# EAGLE design BBMiniPCB5x5 (EAGLE 6.6.0)
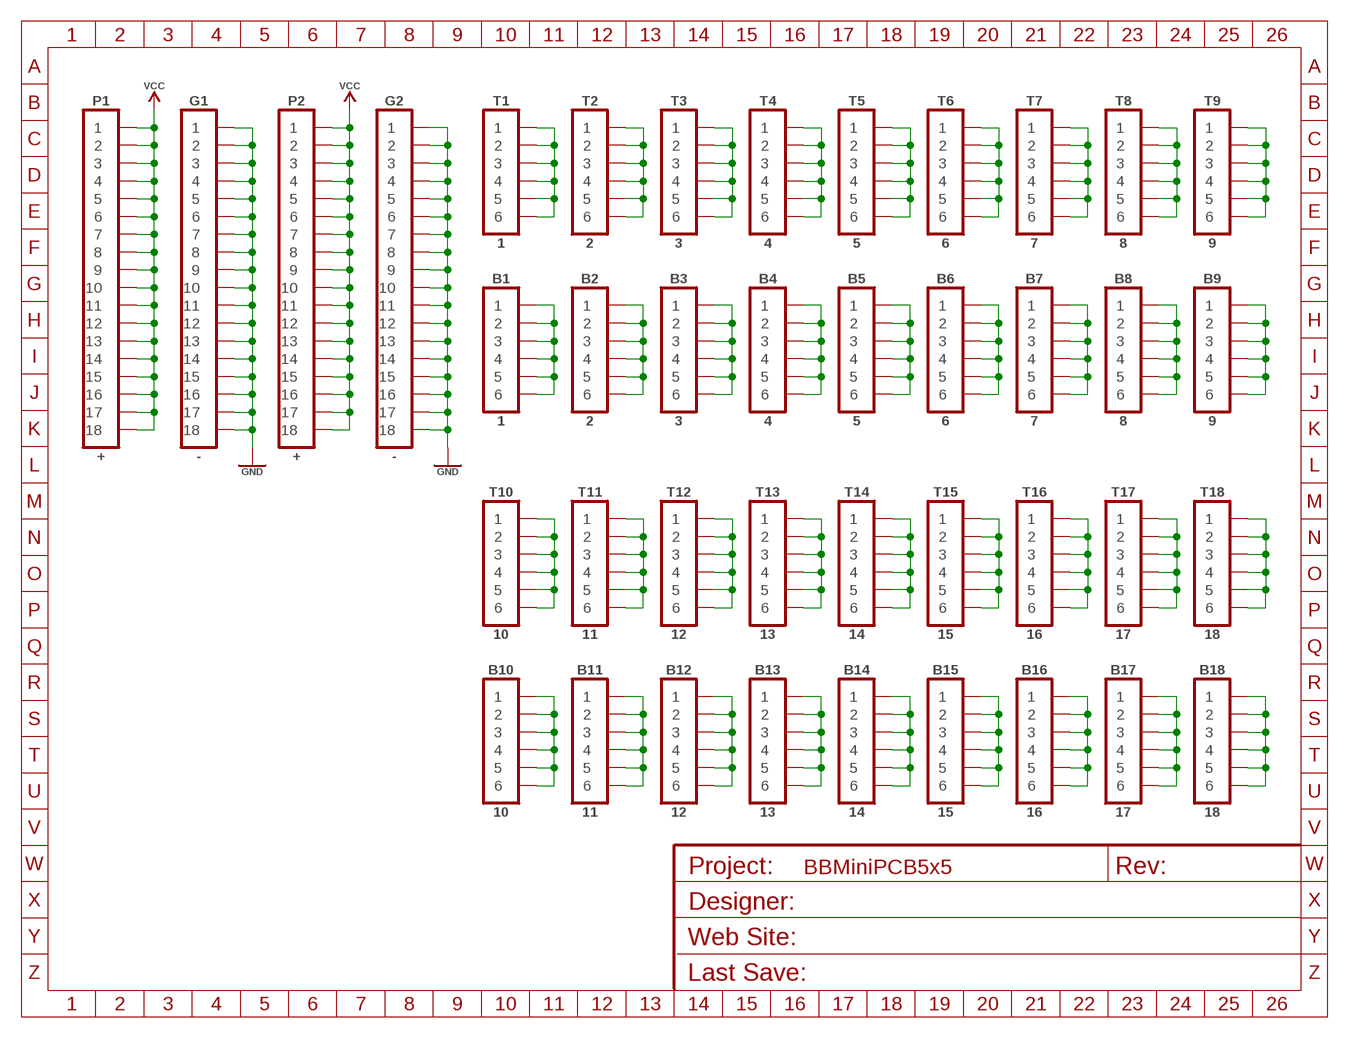
[diagram p0: schematic, sheet 1]
FRAME1 (A5L_FRAME): DESIGNER: Simon/CGTr; REVISION: 1.0; WEBSITE: http://www.commodore.gen.tr

## Parts
B1  1  HDR_1X06_NOSILK  [HDR_1X06_NOSILK]
B2  2  HDR_1X06_NOSILK  [HDR_1X06_NOSILK]
B3  3  HDR_1X06_NOSILK  [HDR_1X06_NOSILK]
B4  4  HDR_1X06_NOSILK  [HDR_1X06_NOSILK]
B5  5  HDR_1X06_NOSILK  [HDR_1X06_NOSILK]
B6  6  HDR_1X06_NOSILK  [HDR_1X06_NOSILK]
B7  7  HDR_1X06_NOSILK  [HDR_1X06_NOSILK]
B8  8  HDR_1X06_NOSILK  [HDR_1X06_NOSILK]
B9  9  HDR_1X06_NOSILK  [HDR_1X06_NOSILK]
B10  10  HDR_1X06_NOSILK  [HDR_1X06_NOSILK]
B11  11  HDR_1X06_NOSILK  [HDR_1X06_NOSILK]
B12  12  HDR_1X06_NOSILK  [HDR_1X06_NOSILK]
B13  13  HDR_1X06_NOSILK  [HDR_1X06_NOSILK]
B14  14  HDR_1X06_NOSILK  [HDR_1X06_NOSILK]
B15  15  HDR_1X06_NOSILK  [HDR_1X06_NOSILK]
B16  16  HDR_1X06_NOSILK  [HDR_1X06_NOSILK]
B17  17  HDR_1X06_NOSILK  [HDR_1X06_NOSILK]
B18  18  HDR_1X06_NOSILK  [HDR_1X06_NOSILK]
G1  -  HDR_1X18_NOSILK  [HDR_1X18_NOSILK]
G2  -  HDR_1X18_NOSILK  [HDR_1X18_NOSILK]
P1  +  HDR_1X18_NOSILK  [HDR_1X18_NOSILK]
P2  +  HDR_1X18_NOSILK  [HDR_1X18_NOSILK]
T1  1  HDR_1X06_NOSILK  [HDR_1X06_NOSILK]
T2  2  HDR_1X06_NOSILK  [HDR_1X06_NOSILK]
T3  3  HDR_1X06_NOSILK  [HDR_1X06_NOSILK]
T4  4  HDR_1X06_NOSILK  [HDR_1X06_NOSILK]
T5  5  HDR_1X06_NOSILK  [HDR_1X06_NOSILK]
T6  6  HDR_1X06_NOSILK  [HDR_1X06_NOSILK]
T7  7  HDR_1X06_NOSILK  [HDR_1X06_NOSILK]
T8  8  HDR_1X06_NOSILK  [HDR_1X06_NOSILK]
T9  9  HDR_1X06_NOSILK  [HDR_1X06_NOSILK]
T10  10  HDR_1X06_NOSILK  [HDR_1X06_NOSILK]
T11  11  HDR_1X06_NOSILK  [HDR_1X06_NOSILK]
T12  12  HDR_1X06_NOSILK  [HDR_1X06_NOSILK]
T13  13  HDR_1X06_NOSILK  [HDR_1X06_NOSILK]
T14  14  HDR_1X06_NOSILK  [HDR_1X06_NOSILK]
T15  15  HDR_1X06_NOSILK  [HDR_1X06_NOSILK]
T16  16  HDR_1X06_NOSILK  [HDR_1X06_NOSILK]
T17  17  HDR_1X06_NOSILK  [HDR_1X06_NOSILK]
T18  18  HDR_1X06_NOSILK  [HDR_1X06_NOSILK]

## Nets
B1: B1.1 B1.2 B1.3 B1.4 B1.5 B1.6
B2: B2.1 B2.2 B2.3 B2.4 B2.5 B2.6
B3: B3.1 B3.2 B3.3 B3.4 B3.5 B3.6
B4: B4.1 B4.2 B4.3 B4.4 B4.5 B4.6
B5: B5.1 B5.2 B5.3 B5.4 B5.5 B5.6
B6: B6.1 B6.2 B6.3 B6.4 B6.5 B6.6
B7: B7.1 B7.2 B7.3 B7.4 B7.5 B7.6
B8: B8.1 B8.2 B8.3 B8.4 B8.5 B8.6
B9: B9.1 B9.2 B9.3 B9.4 B9.5 B9.6
B10: B10.1 B10.2 B10.3 B10.4 B10.5 B10.6
B11: B11.1 B11.2 B11.3 B11.4 B11.5 B11.6
B12: B12.1 B12.2 B12.3 B12.4 B12.5 B12.6
B13: B13.1 B13.2 B13.3 B13.4 B13.5 B13.6
B14: B14.1 B14.2 B14.3 B14.4 B14.5 B14.6
B15: B15.1 B15.2 B15.3 B15.4 B15.5 B15.6
B16: B16.1 B16.2 B16.3 B16.4 B16.5 B16.6
B17: B17.1 B17.2 B17.3 B17.4 B17.5 B17.6
B18: B18.1 B18.2 B18.3 B18.4 B18.5 B18.6
GND: G1.1 G1.2 G1.3 G1.4 G1.5 G1.6 G1.7 G1.8 G1.9 G1.10 G1.11 G1.12 G1.13 G1.14 G1.15 G1.16 G1.17 G1.18 G2.1 G2.2 G2.3 G2.4 G2.5 G2.6 G2.7 G2.8 G2.9 G2.10 G2.11 G2.12 G2.13 G2.14 G2.15 G2.16 G2.17 G2.18
T1: T1.1 T1.2 T1.3 T1.4 T1.5 T1.6
T2: T2.1 T2.2 T2.3 T2.4 T2.5 T2.6
T3: T3.1 T3.2 T3.3 T3.4 T3.5 T3.6
T4: T4.1 T4.2 T4.3 T4.4 T4.5 T4.6
T5: T5.1 T5.2 T5.3 T5.4 T5.5 T5.6
T6: T6.1 T6.2 T6.3 T6.4 T6.5 T6.6
T7: T7.1 T7.2 T7.3 T7.4 T7.5 T7.6
T8: T8.1 T8.2 T8.3 T8.4 T8.5 T8.6
T9: T9.1 T9.2 T9.3 T9.4 T9.5 T9.6
T10: T10.1 T10.2 T10.3 T10.4 T10.5 T10.6
T11: T11.1 T11.2 T11.3 T11.4 T11.5 T11.6
T12: T12.1 T12.2 T12.3 T12.4 T12.5 T12.6
T13: T13.1 T13.2 T13.3 T13.4 T13.5 T13.6
T14: T14.1 T14.2 T14.3 T14.4 T14.5 T14.6
T15: T15.1 T15.2 T15.3 T15.4 T15.5 T15.6
T16: T16.1 T16.2 T16.3 T16.4 T16.5 T16.6
T17: T17.1 T17.2 T17.3 T17.4 T17.5 T17.6
T18: T18.1 T18.2 T18.3 T18.4 T18.5 T18.6
VCC: P1.1 P1.2 P1.3 P1.4 P1.5 P1.6 P1.7 P1.8 P1.9 P1.10 P1.11 P1.12 P1.13 P1.14 P1.15 P1.16 P1.17 P1.18 P2.1 P2.2 P2.3 P2.4 P2.5 P2.6 P2.7 P2.8 P2.9 P2.10 P2.11 P2.12 P2.13 P2.14 P2.15 P2.16 P2.17 P2.18

## Library data of the parts
B1-B18 T1-T18 = sj_connectors:HDR_1X06: 1x06 - 0.1" Pin Header
G1 G2 P1 P2 = sj_connectors:HDR_1X18: 1x22 - 0.1" Pin Header

## Board
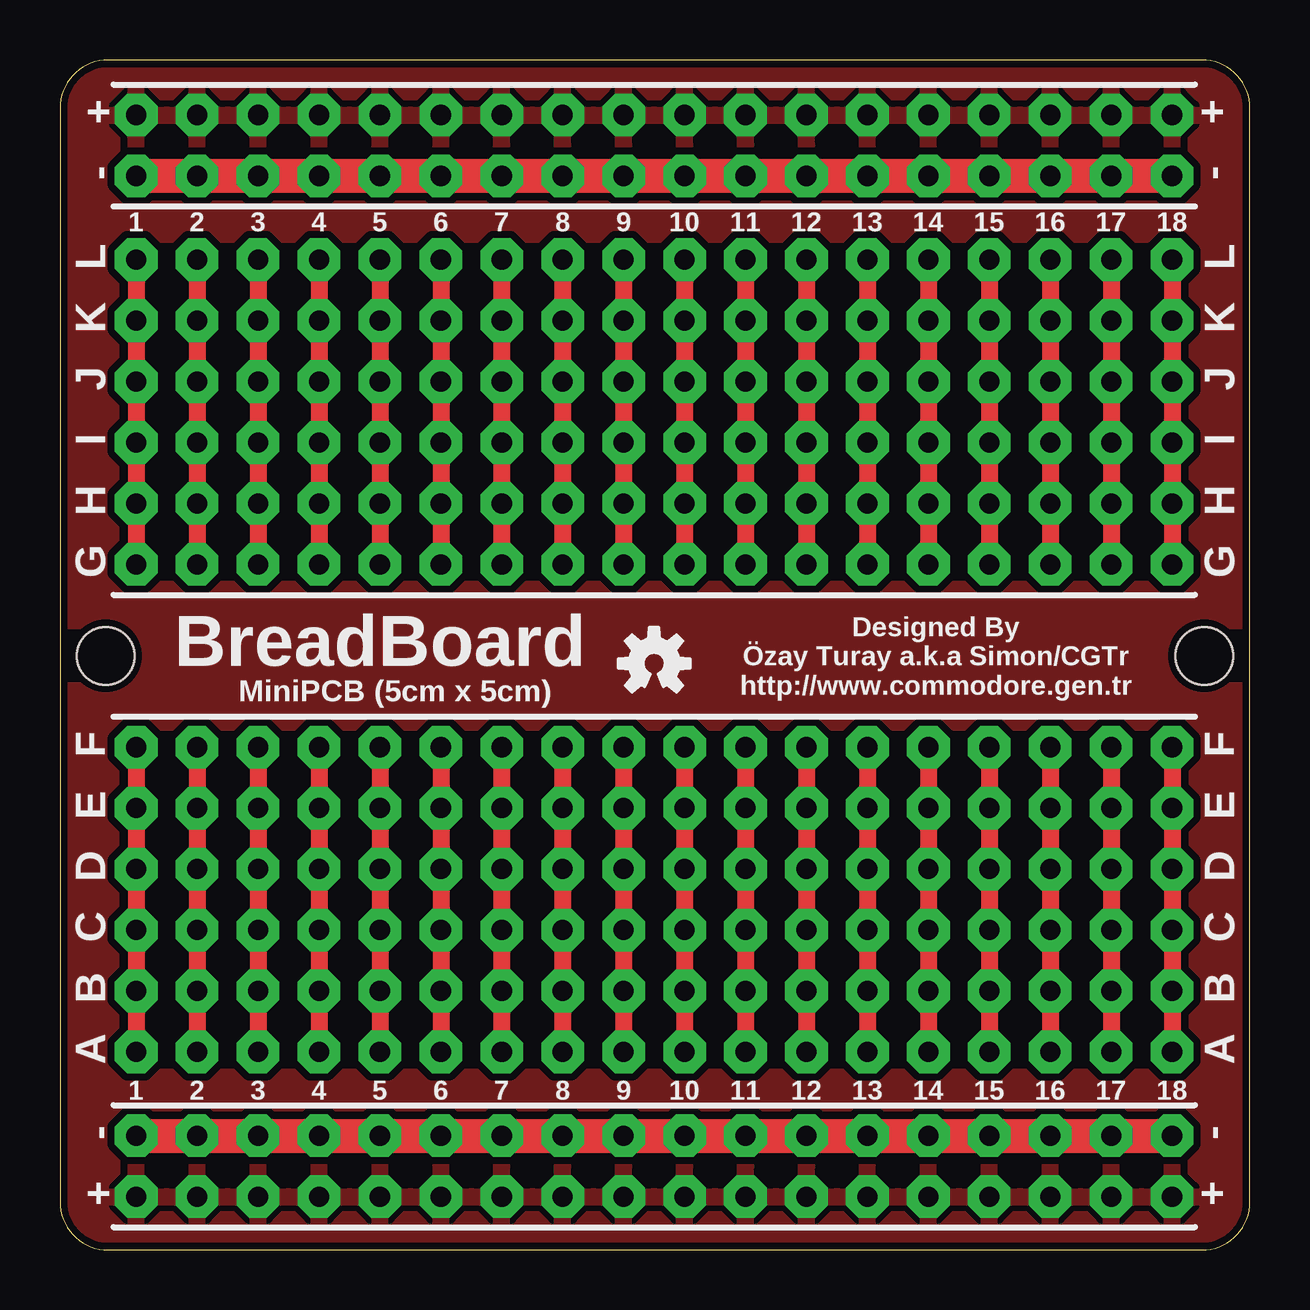
[diagram p1: board, top side]
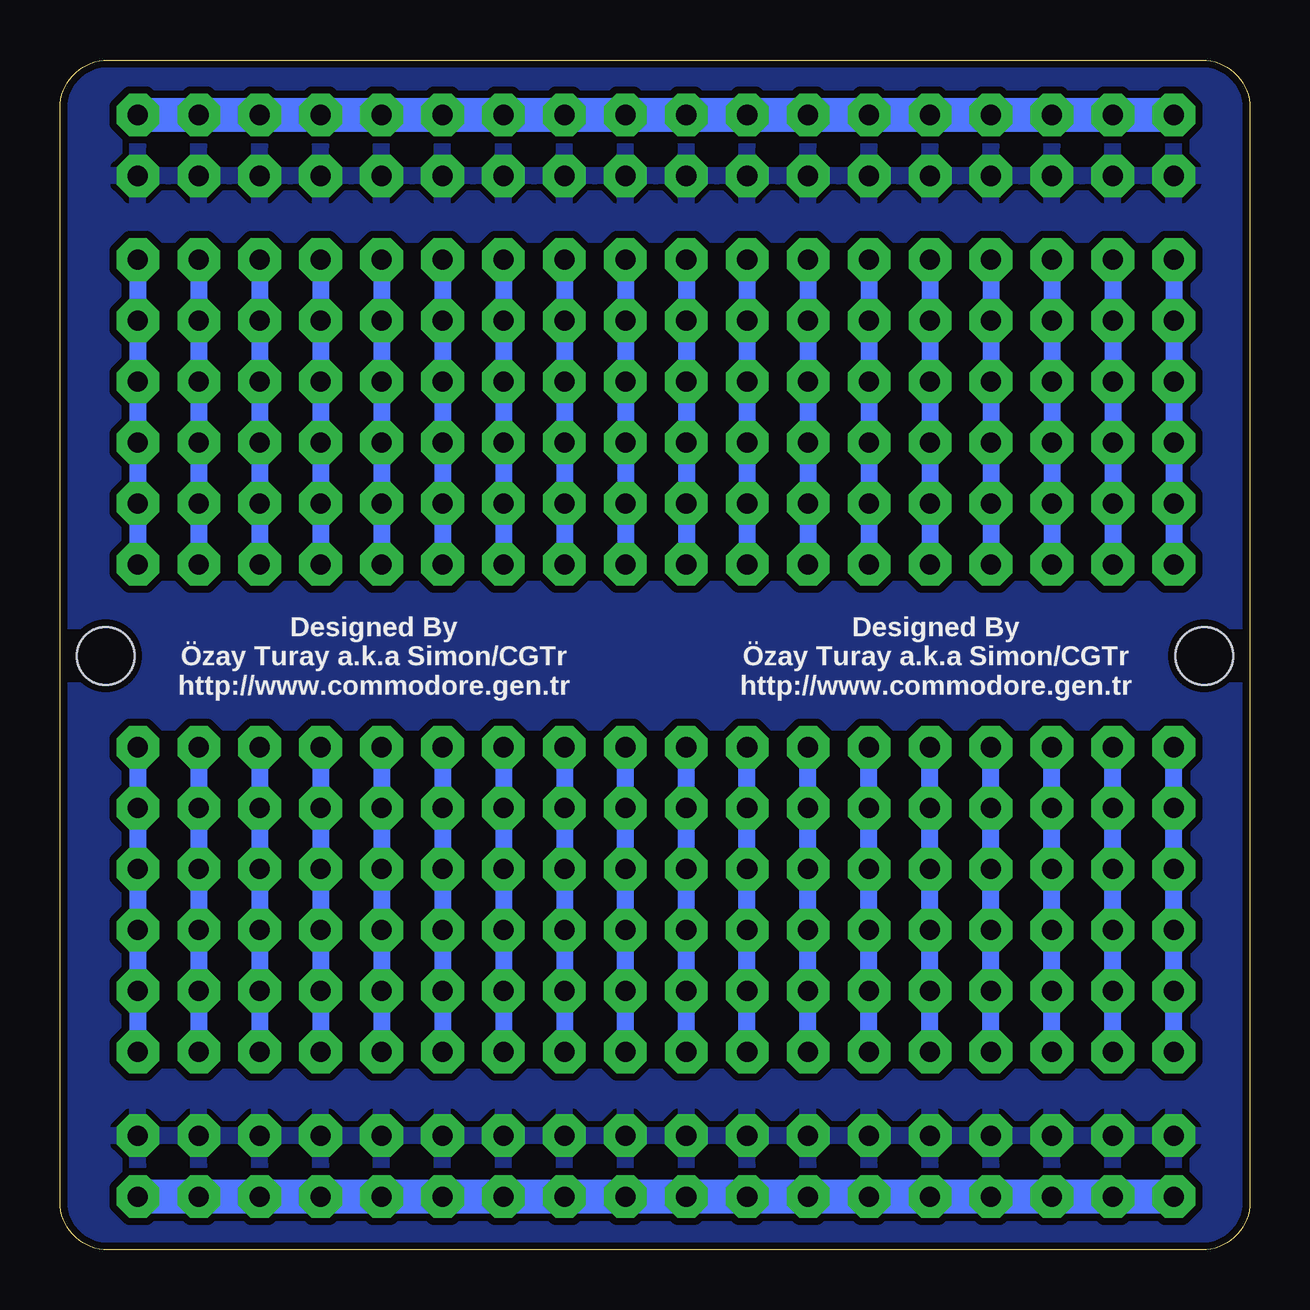
[diagram p2: board, bottom side, seen from below]

Size 49.6 x 49.6 mm. Coordinates in mm from the lower left corner, seen from the top.
Outline: 2,0 47.6,0 arc90 49.6,2 49.6,47.6 arc90 47.6,49.6 2,49.6 arc90 0,47.6 0,2 arc90 2,0
Copper layers (1*16): Top 0.035mm / dielectric 1.5mm / Bottom 0.035mm
Design rules "DirtyPCBs": minimum track width 5mil, minimum drill 12mil, track to track 5mil, track to pad 5mil, pad to pad 5mil, via to via 5mil, smd to smd 0mil, copper to edge 10mil, drill to drill 10mil, minimum pad ring 10mil, minimum via ring 6mil, stop-mask expansion 2mil, vias tented up to drill 25mil, thermal gap 10mil
Holes 2.4 mm at 1.91,24.77 47.7,24.77

### Footprints (pad centres in the part's own frame; a part is rotated, then mirrored left to right if it is on the bottom)
HDR_1X06_NOSILK = drill 0.838 pad 1.778 octagon: 1 0,0; 2 2.54,0; 3 5.08,0; 4 7.62,0; 5 10.16,0; 6 12.7,0
HDR_1X18_NOSILK = drill 0.838 pad 1.778 octagon: 1 0,0; 2 2.54,0; 3 5.08,0; 4 7.62,0; 5 10.16,0; 6 12.7,0; 7 15.24,0; 8 17.78,0; 9 20.32,0; 10 22.86,0; 11 25.4,0; 12 27.94,0; 13 30.48,0; 14 33.02,0; 15 35.56,0; 16 38.1,0; 17 40.64,0; 18 43.18,0

### Placement (x,y rotation side)
B1  3.17,8.26 90 top
B2  5.71,8.26 90 top
B3  8.26,8.26 90 top
B4  10.79,8.26 90 top
B5  13.34,8.26 90 top
B6  15.88,8.26 90 top
B7  18.41,8.26 90 top
B8  20.95,8.26 90 top
B9  23.5,8.26 90 top
B10  26.04,8.26 90 top
B11  28.57,8.26 90 top
B12  31.11,8.26 90 top
B13  33.66,8.26 90 top
B14  36.2,8.26 90 top
B15  38.73,8.26 90 top
B16  41.27,8.26 90 top
B17  43.81,8.26 90 top
B18  46.35,8.26 90 top
G1  3.17,4.76 0 top
G2  3.17,44.77 0 top
LOGO1  OSHW_LOGO_SMALL  [OSHW_LOGO_SMALL]  24.77,24.45 0 top
P1  3.17,2.22 0 top
P2  3.17,47.31 0 top
T1  3.17,41.27 270 top
T2  5.71,41.27 270 top
T3  8.26,41.27 270 top
T4  10.79,41.27 270 top
T5  13.34,41.27 270 top
T6  15.88,41.27 270 top
T7  18.41,41.27 270 top
T8  20.95,41.27 270 top
T9  23.5,41.27 270 top
T10  26.04,41.27 270 top
T11  28.57,41.27 270 top
T12  31.11,41.27 270 top
T13  33.66,41.27 270 top
T14  36.2,41.27 270 top
T15  38.73,41.27 270 top
T16  41.27,41.27 270 top
T17  43.81,41.27 270 top
T18  46.35,41.27 270 top

### Tracks (layer width: path | path; a pad name or v marks a point on that pad's centre or on a via)
B1
  Top 0.711: B1.6 B1.5 B1.4 B1.3 B1.2 B1.1
  Bottom 0.711: B1.1 B1.6
B2
  Top 0.711: B2.6 B2.5 B2.4 B2.3 B2.2 B2.1
  Bottom 0.711: B2.1 B2.6
B3
  Top 0.711: B3.6 B3.5 B3.4 B3.3 B3.2 B3.1
  Bottom 0.711: B3.1 B3.6
B4
  Top 0.711: B4.6 B4.5 B4.4 B4.3 B4.2 B4.1
  Bottom 0.711: B4.1 B4.6
B5
  Top 0.711: B5.6 B5.5 B5.4 B5.3 B5.2 B5.1
  Bottom 0.711: B5.1 B5.6
B6
  Top 0.711: B6.6 B6.5 B6.4 B6.3 B6.2 B6.1
  Bottom 0.711: B6.1 B6.6
B7
  Top 0.711: B7.6 B7.5 B7.4 B7.3 B7.2 B7.1
  Bottom 0.711: B7.1 B7.6
B8
  Top 0.711: B8.6 B8.5 B8.4 B8.3 B8.2 B8.1
  Bottom 0.711: B8.1 B8.6
B9
  Top 0.711: B9.6 B9.5 B9.4 B9.3 B9.2 B9.1
  Bottom 0.711: B9.1 B9.6
B10
  Top 0.711: B10.6 B10.5 B10.4 B10.3 B10.2 B10.1
  Bottom 0.711: B10.1 B10.6
B11
  Top 0.711: B11.6 B11.5 B11.4 B11.3 B11.2 B11.1
  Bottom 0.711: B11.6 B11.1
B12
  Top 0.711: B12.6 B12.5 B12.4 B12.3 B12.2 B12.1
  Bottom 0.711: B12.6 B12.1
B13
  Top 0.711: B13.6 B13.5 B13.4 B13.3 B13.2 B13.1
  Bottom 0.711: B13.6 B13.1
B14
  Top 0.711: B14.6 B14.5 B14.4 B14.3 B14.2 B14.1
  Bottom 0.711: B14.6 B14.1
B15
  Top 0.711: B15.6 B15.5 B15.4 B15.3 B15.2 B15.1
  Bottom 0.711: B15.6 B15.1
B16
  Top 0.711: B16.6 B16.5 B16.4 B16.3 B16.2 B16.1
  Bottom 0.711: B16.6 B16.1
B17
  Top 0.711: B17.6 B17.5 B17.4 B17.3 B17.2 B17.1
  Bottom 0.711: B17.6 B17.1
B18
  Top 0.711: B18.6 B18.5 B18.4 B18.3 B18.2 B18.1
  Bottom 0.711: B18.6 B18.1
GND
  Top 0.813: 46.4,44.77 46.4,44.8 | 46.4,4.76 46.4,4.8
  Top 1.422: G2.1 46.4,44.77 | G1.1 46.4,4.76
  pour Bottom (isolate 0.305): 0,49.6 0,0 49.6,0 49.6,49.6
T1
  Top 0.711: T1.1 T1.2 T1.3 T1.4 T1.5 T1.6
  Bottom 0.711: T1.1 T1.6
T2
  Top 0.711: T2.1 T2.2 T2.3 T2.4 T2.5 T2.6
  Bottom 0.711: T2.1 T2.6
T3
  Top 0.711: T3.1 T3.2 T3.3 T3.4 T3.5 T3.6
  Bottom 0.711: T3.1 T3.6
T4
  Top 0.711: T4.1 T4.2 T4.3 T4.4 T4.5 T4.6
  Bottom 0.711: T4.1 T4.6
T5
  Top 0.711: T5.1 T5.2 T5.3 T5.4 T5.5 T5.6
  Bottom 0.711: T5.1 T5.6
T6
  Top 0.711: T6.1 T6.2 T6.3 T6.4 T6.5 T6.6
  Bottom 0.711: T6.1 T6.6
T7
  Top 0.711: T7.1 T7.2 T7.3 T7.4 T7.5 T7.6
  Bottom 0.711: T7.1 T7.6
T8
  Top 0.711: T8.1 T8.2 T8.3 T8.4 T8.5 T8.6
  Bottom 0.711: T8.1 T8.6
T9
  Top 0.711: T9.1 T9.2 T9.3 T9.4 T9.5 T9.6
  Bottom 0.711: T9.1 T9.6
T10
  Top 0.711: T10.1 T10.2 T10.3 T10.4 T10.5 T10.6
  Bottom 0.711: T10.1 T10.6
T11
  Top 0.711: T11.1 T11.2 T11.3 T11.4 T11.5 T11.6
  Bottom 0.711: T11.1 T11.6
T12
  Top 0.711: T12.1 T12.2 T12.3 T12.4 T12.5 T12.6
  Bottom 0.711: T12.1 T12.6
T13
  Top 0.711: T13.1 T13.2 T13.3 T13.4 T13.5 T13.6
  Bottom 0.711: T13.1 T13.6
T14
  Top 0.711: T14.1 T14.2 T14.3 T14.4 T14.5 T14.6
  Bottom 0.711: T14.1 T14.6
T15
  Top 0.711: T15.1 T15.2 T15.3 T15.4 T15.5 T15.6
  Bottom 0.711: T15.1 T15.6
T16
  Top 0.711: T16.1 T16.2 T16.3 T16.4 T16.5 T16.6
  Bottom 0.711: T16.1 T16.6
T17
  Top 0.711: T17.1 T17.2 T17.3 T17.4 T17.5 T17.6
  Bottom 0.711: T17.1 T17.6
T18
  Top 0.711: T18.1 T18.2 T18.3 T18.4 T18.5 T18.6
  Bottom 0.711: T18.1 T18.6
VCC
  Bottom 1.422: P2.1 P2.18 | P1.1 P1.18
  pour Top (isolate 0.305): 0,49.6 0,0 49.6,0 49.6,49.6

### Text on the board
tPlace: + | - | L | L | K | K | J | J | I | I | H | H | G | G | BreadBoard | Designed By / Özay Turay a.k.a Simon/CGTr / http://www.commodore.gen.tr | MiniPCB (5cm x 5cm) | F | F | E | E | D | D | C | C | B | B | A | A | - | +
bPlace: Designed By / Özay Turay a.k.a Simon/CGTr / http://www.commodore.gen.tr | Designed By / Özay Turay a.k.a Simon/CGTr / http://www.commodore.gen.tr